# Altium project Traffic_Lignt_CU.PrjPCB
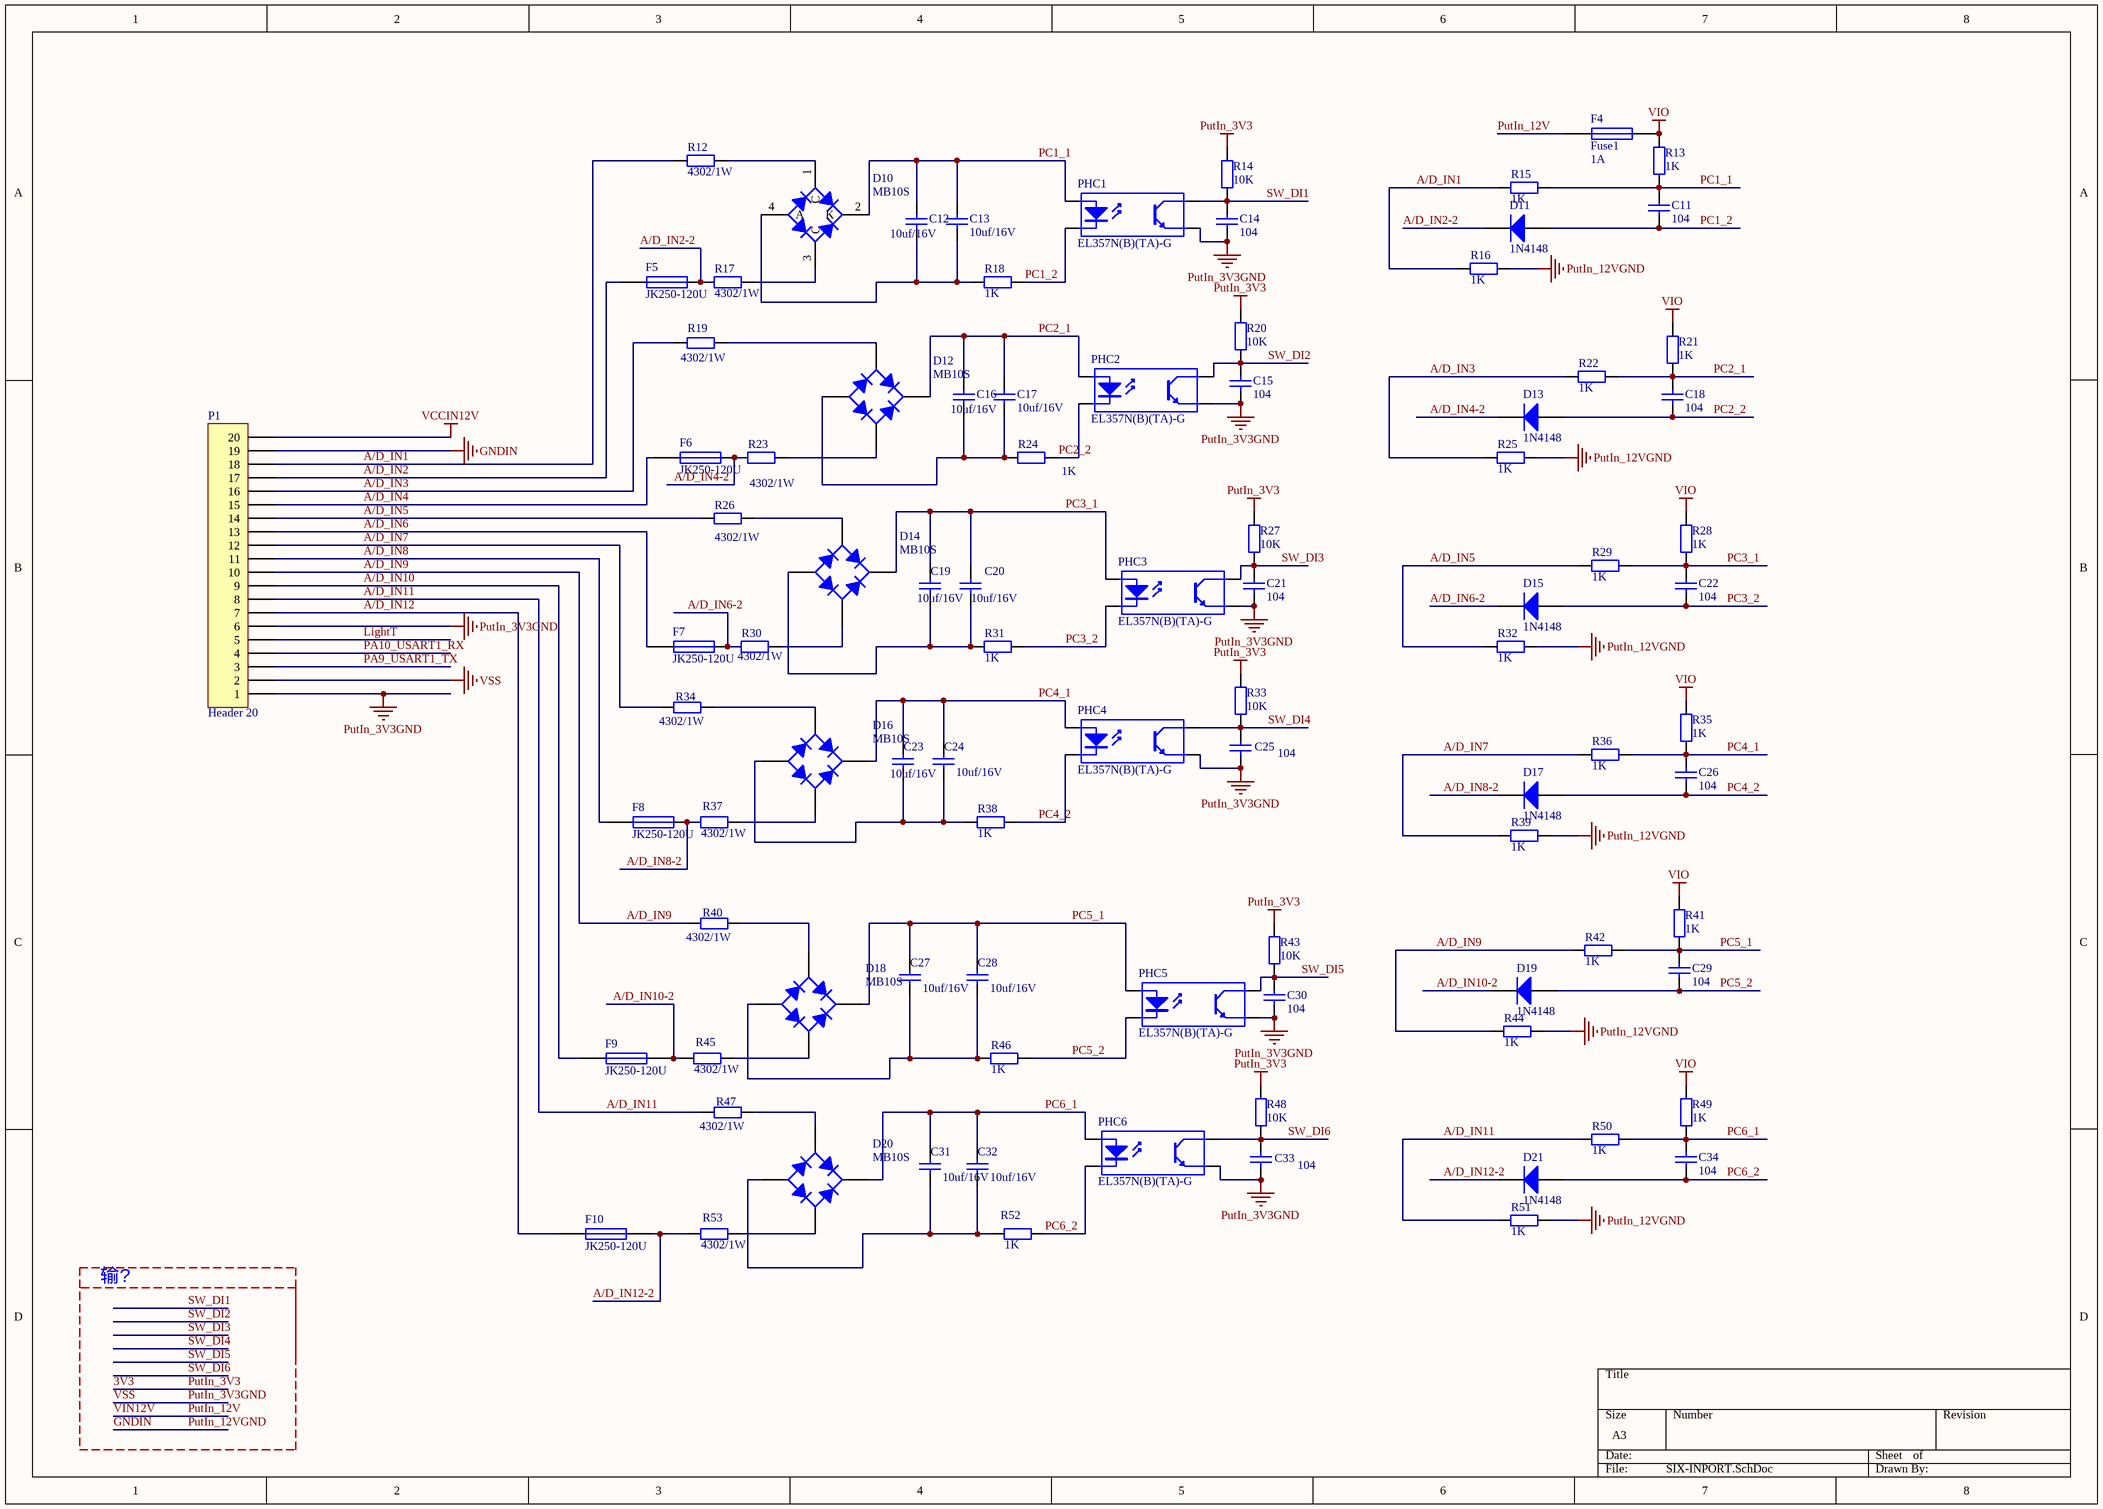
[diagram p0: SIX-INPORT.SchDoc]
5 sheets, 302 parts. Net scope: global (net labels, ports and power ports of the same name join across sheets).
Board file: PCB_LU_V2.2PcbDoc.PcbDoc
Sheets:
  SIX-INPORT.SchDoc
  RS485.SchDoc
  SIX_OUTPORT-V2.SchDoc
  POWER.SchDoc
  STM32F103最小系统板.SchDoc

## Sheet SIX-INPORT.SchDoc
size A3

### Parts
(Parts that share a designator on the sheet are numbered #1, #2 ... from top to bottom, then left to right.)
C11  104  [LC-1206_C]
C12  10uf/16V  [LC-0805_C]
C13  10uf/16V  [LC-0805_C]
C14#1  104  [LC-0603_C]
C15#1  104  [LC-0603_C]
C16  10uf/16V  [LC-0805_C]
C17  10uf/16V  [LC-0805_C]
C18#1  104  [LC-1206_C]
C19#1  10uf/16V  [LC-0805_C]
C20  10uf/16V  [LC-0805_C]
C21  104  [LC-0603_C]
C22  104  [LC-1206_C]
C23#1  10uf/16V  [LC-0805_C]
C24  10uf/16V  [LC-0805_C]
C25  104  [LC-0603_C]
C26  104  [LC-1206_C]
C27  10uf/16V  [LC-0805_C]
C28  10uf/16V  [LC-0805_C]
C29  104  [LC-1206_C]
C30  104  [LC-0603_C]
C31  10uf/16V  [LC-0805_C]
C32  10uf/16V  [LC-0805_C]
C33  104  [LC-0603_C]
C34  104  [LC-1206_C]
D10  MB10S  [LC-MBS]
D11  1N4148  [LC-LL-34]
D12  MB10S  [LC-MBS]
D13  1N4148  [LC-LL-34]
D14  MB10S  [LC-MBS]
D15  1N4148  [LC-LL-34]
D16#1  MB10S  [LC-MBS]
D17  1N4148  [LC-LL-34]
D18  MB10S  [LC-MBS]
D19  1N4148  [LC-LL-34]
D20  MB10S  [LC-MBS]
D21  1N4148  [LC-LL-34]
F4  Fuse1  value 1A  [LC-1206_R]
F5  JK250-120U  [ntc250v]
F6  JK250-120U  [ntc250v]
F7  JK250-120U  [ntc250v]
F8  JK250-120U  [ntc250v]
F9  JK250-120U  [ntc250v]
F10  JK250-120U  [ntc250v]
P1  Header 20  [HDR_5.0_20P]
PHC1  EL357N(B)(TA)-G  [LC-SOP-4_P2.54]
PHC2  EL357N(B)(TA)-G  [LC-SOP-4_P2.54]
PHC3  EL357N(B)(TA)-G  [LC-SOP-4_P2.54]
PHC4  EL357N(B)(TA)-G  [LC-SOP-4_P2.54]
PHC5  EL357N(B)(TA)-G  [LC-SOP-4_P2.54]
PHC6  EL357N(B)(TA)-G  [LC-SOP-4_P2.54]
R12  4302/1W  [LC-2512_R]
R13  value 1K  [LC-1206_R]  (hidden comment: Res1)
R14  10K  [LC-0603_R]
R15#1  value 1K  [LC-1206_R]  (hidden comment: Res1)
R16#1  value 1K  [LC-1206_R]  (hidden comment: Res1)
R17#1  4302/1W  [LC-2512_R]
R18#1  1K  [LC-0603_R]
R19  4302/1W  [LC-2512_R]
R20  10K  [LC-0603_R]
R21  value 1K  [LC-1206_R]  (hidden comment: Res1)
R22  value 1K  [LC-1206_R]  (hidden comment: Res1)
R23  4302/1W  [LC-2512_R]
R24  1K  [LC-0603_R]
R25  value 1K  [LC-1206_R]  (hidden comment: Res1)
R26  4302/1W  [LC-2512_R]
R27  10K  [LC-0603_R]
R28#1  value 1K  [LC-1206_R]  (hidden comment: Res1)
R29  value 1K  [LC-1206_R]  (hidden comment: Res1)
R30  4302/1W  [LC-2512_R]
R31  1K  [LC-0603_R]
R32  value 1K  [LC-1206_R]  (hidden comment: Res1)
R33  10K  [LC-0603_R]
R34  4302/1W  [LC-2512_R]
R35  value 1K  [LC-1206_R]  (hidden comment: Res1)
R36  value 1K  [LC-1206_R]  (hidden comment: Res1)
R37  4302/1W  [LC-2512_R]
R38  1K  [LC-0603_R]
R39  value 1K  [LC-1206_R]  (hidden comment: Res1)
R40  4302/1W  [LC-2512_R]
R41  value 1K  [LC-1206_R]  (hidden comment: Res1)
R42  value 1K  [LC-1206_R]  (hidden comment: Res1)
R43  10K  [LC-0603_R]
R44  value 1K  [LC-1206_R]  (hidden comment: Res1)
R45  4302/1W  [LC-2512_R]
R46  1K  [LC-0603_R]
R47  4302/1W  [LC-2512_R]
R48  10K  [LC-0603_R]
R49  value 1K  [LC-1206_R]  (hidden comment: Res1)
R50  value 1K  [LC-1206_R]  (hidden comment: Res1)
R51  value 1K  [LC-1206_R]  (hidden comment: Res1)
R52  1K  [LC-0603_R]
R53  4302/1W  [LC-2512_R]

### Nets
3V3: R14.2 R20.2 R27.2 R33.2 R43.2 R48.2  [also labelled PutIn_3V3]
GNDIN: P1.19 R16#1.1 R25.1 R32.1 R39.1 R44.1 R51.1  [also labelled PutIn_12VGND]
PutIn_3V3GND: C14#1.2 C15#1.2 C21.2 C25.2 C30.2 C33.2 P1.1 P1.2 P1.6 PHC1.3(E) PHC2.3(E) PHC3.3(E) PHC4.3(E) PHC5.3(E) PHC6.3(E)  [also labelled VSS]
PutIn_12V: F4.1  [also labelled VIN12V]
VCCIN12V: P1.20
VIO: F4.2 R13.2 R21.1 R28#1.1 R35.1 R41.1 R49.1
A/D_IN1: P1.18 R12.1 R15#1.2 R16#1.2
A/D_IN2: F5.1 P1.17
A/D_IN2-2: D11.2(K) F5.2 R17#1.1
A/D_IN3: P1.16 R19.1 R22.2 R25.2
A/D_IN4: F6.1 P1.15
A/D_IN4-2: D13.2(K) F6.2 R23.1
A/D_IN5: P1.14 R26.1 R29.2 R32.2
A/D_IN6: F7.1 P1.13
A/D_IN6-2: D15.2(K) F7.2 R30.1
A/D_IN7: P1.12 R34.1 R36.2 R39.2
A/D_IN8: F8.1 P1.11
A/D_IN8-2: D17.2(K) F8.2 R37.1
A/D_IN9: P1.10 R40.1 R42.2 R44.2
A/D_IN10: F9.1 P1.9
A/D_IN10-2: D19.2(K) F9.2 R45.1
A/D_IN11: P1.8 R47.1 R50.2 R51.2
A/D_IN12: F10.1 P1.7
A/D_IN12-2: D21.2(K) F10.2 R53.1
LightT: P1.5
PA9_USART1_TX: P1.3
PA10_USART1_RX: P1.4
PC1_1: C11.1 C12.2 C13.2 D10.2(K) PHC1.1(A) R13.1 R15#1.1
PC1_2: C11.2 D11.1(A) PHC1.2(K) R18#1.1
PC2_1: C16.2 C17.2 C18#1.1 D12.2(K) PHC2.1(A) R21.2 R22.1
PC2_2: C18#1.2 D13.1(A) PHC2.2(K) R24.1
PC3_1: C19#1.2 C20.2 C22.1 D14.2(K) PHC3.1(A) R28#1.2 R29.1
PC3_2: C22.2 D15.1(A) PHC3.2(K) R31.1
PC4_1: C23#1.2 C24.2 C26.1 D16#1.2(K) PHC4.1(A) R35.2 R36.1
PC4_2: C26.2 D17.1(A) PHC4.2(K) R38.1
PC5_1: C27.2 C28.2 C29.1 D18.2(K) PHC5.1(A) R41.2 R42.1
PC5_2: C29.2 D19.1(A) PHC5.2(K) R46.1
PC6_1: C31.2 C32.2 C34.1 D20.2(K) PHC6.1(A) R49.2 R50.1
PC6_2: C34.2 D21.1(A) PHC6.2(K) R52.1
SW_DI1: C14#1.1 PHC1.4(C) R14.1
SW_DI2: C15#1.1 PHC2.4(C) R20.1
SW_DI3: C21.1 PHC3.4(C) R27.1
SW_DI4: C25.1 PHC4.4(C) R33.1
SW_DI5: C30.1 PHC5.4(C) R43.1
SW_DI6: C33.1 PHC6.4(C) R48.1
NetC12_1: C12.1 C13.1 D10.4(A) R18#1.2
NetC16_1: C16.1 C17.1 D12.4(A) R24.2
NetC19#1_1: C19#1.1 C20.1 D14.4(A) R31.2
NetC23#1_1: C23#1.1 C24.1 D16#1.4(A) R38.2
NetC27_1: C27.1 C28.1 D18.4(A) R46.2
NetC31_1: C31.1 C32.1 D20.4(A) R52.2
NetD10_1: D10.1(C) R12.2
NetD10_3: D10.3(C) R17#1.2
NetD12_1: D12.1(C) R19.2
NetD12_3: D12.3(C) R23.2
NetD14_1: D14.1(C) R26.2
NetD14_3: D14.3(C) R30.2
NetD16#1_1: D16#1.1(C) R34.2
NetD16#1_3: D16#1.3(C) R37.2
NetD18_1: D18.1(C) R40.2
NetD18_3: D18.3(C) R45.2
NetD20_1: D20.1(C) R47.2
NetD20_3: D20.3(C) R53.2

### Notes on the sheet
- 输?

### Library data of the parts
C11 C18#1 C22 C26 C29 C34 = Cap: Capacitor; Value: 100nF; Published: 8-Jun-2000; Revision: July-2002: Re-released for DXP Platform.; Publisher: Altium Limited
C12 C13 C14#1 C15#1 C16 C17 C19#1 C20 C21 C23#1 C24 C25 C27 C28 C30-C33 = Cap: Capacitor; Value: 100pF; Published: 8-Jun-2000; LatestRevisionDate: 17-Jul-2002; LatestRevisionNote: Re-released for DXP Platform.; PackageReference: RAD-0.3; Publisher: Altium Limited; PackageDescription: Radial Cap, Thru-Hole; 2 Leads; 0.3 in Pin Spacing
D10 D12 D14 D16#1 D18 D20 = MBS: 整流桥; ComponentLink1Description: 供应商链接; ComponentLink1URL: http://www.szlcsc.com/product/details_2865.html; Package: MBS; Supplier: LC; SuppliersPartNumber: C2488
D11 D13 D15 D17 D19 D21 = Diode: Default Diode; Published: 8-Jun-2000; LatestRevisionDate: 17-Jul-2002; LatestRevisionNote: Re-released for DXP Platform.; PackageDocument: Sep-1996; PackageReference: SMC; Publisher: Altium Limited; Code_JEDEC: DO-214-AB
F4 = F: 保险丝
F5-F10 = Fuse1: 保险丝; Value: 1A
P1 = Header 20: Header, 20-Pin; LatestRevisionDate: 17-Jul-2002; LatestRevisionNote: Re-released for DXP Platform.; Publisher: Altium Limited
PHC1-PHC6 = EL357N: 贴片光耦; ComponentLink1Description: 供应商链接; ComponentLink1URL: http://www.szlcsc.com/product/details_7114.html; Package: SOP-4_P2.54; Supplier: LC; SuppliersPartNumber: C6649
R12 R14 R17#1 R19 R20 R23 R26 R27 R30 R33 R34 R37 R40 R43 R45 R47 R48 R53 = Res2: Resistor; Value: 1K; Published: 8-Jun-2000; LatestRevisionDate: 17-Jul-2002; LatestRevisionNote: Re-released for DXP Platform.; PackageReference: AXIAL-0.4; Publisher: Altium Limited; PackageDescription: Axial Device, Thru-Hole; 2 Leads; 0.4 in Pin Spacing
R13 R15#1 R16#1 R21 R22 R25 R28#1 R29 R32 R35 R36 R39 R41 R42 R44 R49-R51 = R: 贴片电阻; Published: 8-Jun-2000; LatestRevisionDate: 17-Jul-2002; LatestRevisionNote: Re-released for DXP Platform.; PackageReference: AXIAL-0.4; Publisher: Altium Limited
R18#1 R24 R31 R38 R46 R52 = Res2: Resistor; Published: 8-Jun-2000; LatestRevisionDate: 17-Jul-2002; LatestRevisionNote: Re-released for DXP Platform.; PackageReference: AXIAL-0.4; Publisher: Altium Limited; PackageDescription: Axial Device, Thru-Hole; 2 Leads; 0.4 in Pin Spacing; Value: 1K

## Sheet RS485.SchDoc
size A4
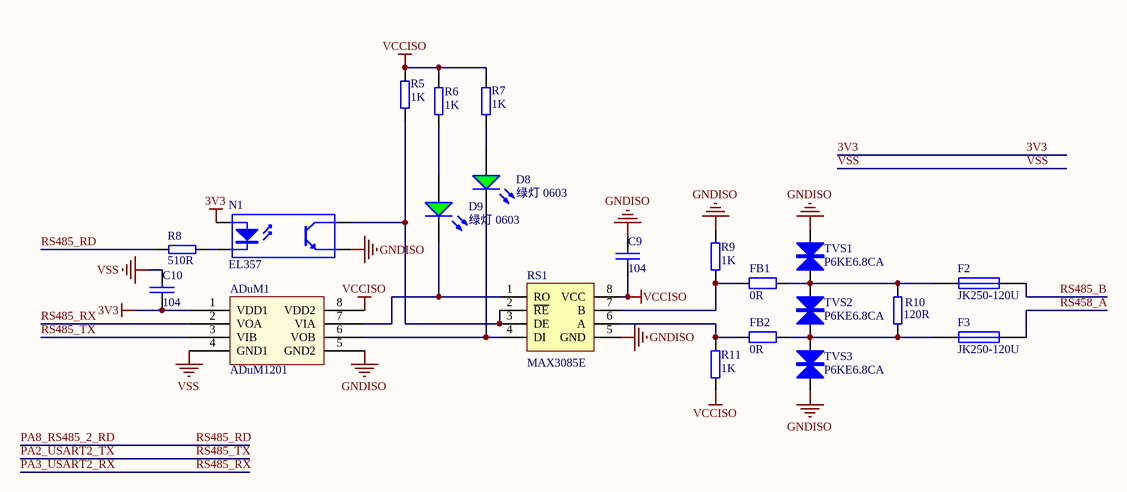
[diagram p1: RS485.SchDoc]

### Parts
(Parts that share a designator on the sheet are numbered #1, #2 ... from top to bottom, then left to right.)
ADuM1  ADuM1201  [SOIC-8]
C9  104  [LC-0603_C]
C10  104  [LC-0603_C]
D8  绿灯 0603  [0603_LED_G]
D9  绿灯 0603  [0603_LED_G]
F2#1  JK250-120U  [ntc250v]
F3  JK250-120U  [ntc250v]
FB1  0R  [LC-0603_L]
FB2  0R  [LC-0603_L]
N1  EL357  [lc-sop-4_P2.54]
R5#1  1K  [LC-0603_R]
R6#1  1K  [LC-0603_R]
R7  1K  [LC-0603_R]
R8  510R  [LC-0603_R]
R9  1K  [LC-0603_R]
R10  120R  [LC-0603_R]
R11  1K  [LC-0603_R]
RS1  MAX3085E  [SOIC-8]
TVS1  P6KE6.8CA  [TVS]
TVS2  P6KE6.8CA  [TVS]
TVS3  P6KE6.8CA  [TVS]

### Nets
3V3: ADuM1.1(VDD1) C10.2 N1.1(A)
GNDISO: ADuM1.5(GND2) C9.1 N1.3(E) R9.1 RS1.5(GND) TVS1.2 TVS3.1
VCCISO: ADuM1.8(VDD2) C9.2 R5#1.1 R6#1.2 R7.1 R11.2 RS1.8(VCC)
VSS: ADuM1.4(GND1) C10.1  [project net PutIn_3V3GND]
PA2_USART2_TX: ADuM1.3(VIB)  [also labelled RS485_TX]
PA3_USART2_RX: ADuM1.2(VOA)  [also labelled RS485_RX]
PA8_RS485_2_RD: R8.1  [also labelled RS485_RD]
RS458_A: F3.2
RS485_B: F2#1.2
NetADuM1_6: ADuM1.6(VOB) D8.K RS1.4(DI)
NetADuM1_7: ADuM1.7(VIA) D9.K RS1.1(RO)
NetD8_A: D8.A R7.2
NetD9_A: D9.A R6#1.1
NetF2#1_1: F2#1.1 FB1.1 R10.2 TVS1.1 TVS2.2
NetF3_1: F3.1 FB2.1 R10.1 TVS2.1 TVS3.2
NetFB1_2: FB1.2 R9.2 RS1.7(B)
NetFB2_2: FB2.2 R11.1 RS1.6(A)
NetN1_2: N1.2(K) R8.2
NetN1_4: N1.4(C) R5#1.2 RS1.2(~{RE}) RS1.3(DE)

### Library data of the parts
C9 C10 = CAP
D8 D9 = 0: 发光二极管; ComponentLink1Descrip: 供应商链接; ComponentLink1URL: http://www.szlcsc.com/product/details_73152.html; Package: 0603; Supplier: LC; SuppliersPartNumber: C72043
F2#1 F3 = F: 保险丝; Value: 1A
FB1 FB2 = Res2: Resistor; Published: 8-Jun-2000; LatestRevisionDate: 17-Jul-2002; LatestRevisionNote: Re-released for DXP Platform.; PackageReference: AXIAL-0.4; Publisher: Altium Limited; Value: 0R
N1 = ST188: 反射式光电传感器; Published: 24-Mar-1999; LatestRevisionDate: 04-Mar-2005; LatestRevisionNote: Sch pins 3 & 4 Swapped.; DatasheetDocument: Nov-2003; PackageReference: DIP-4; Publisher: Altium Limited
R5#1 R6#1 R7 R8 = RES2
R9-R11 = RES
TVS1-TVS3 = TVS

## Sheet SIX_OUTPORT-V2.SchDoc
size A3
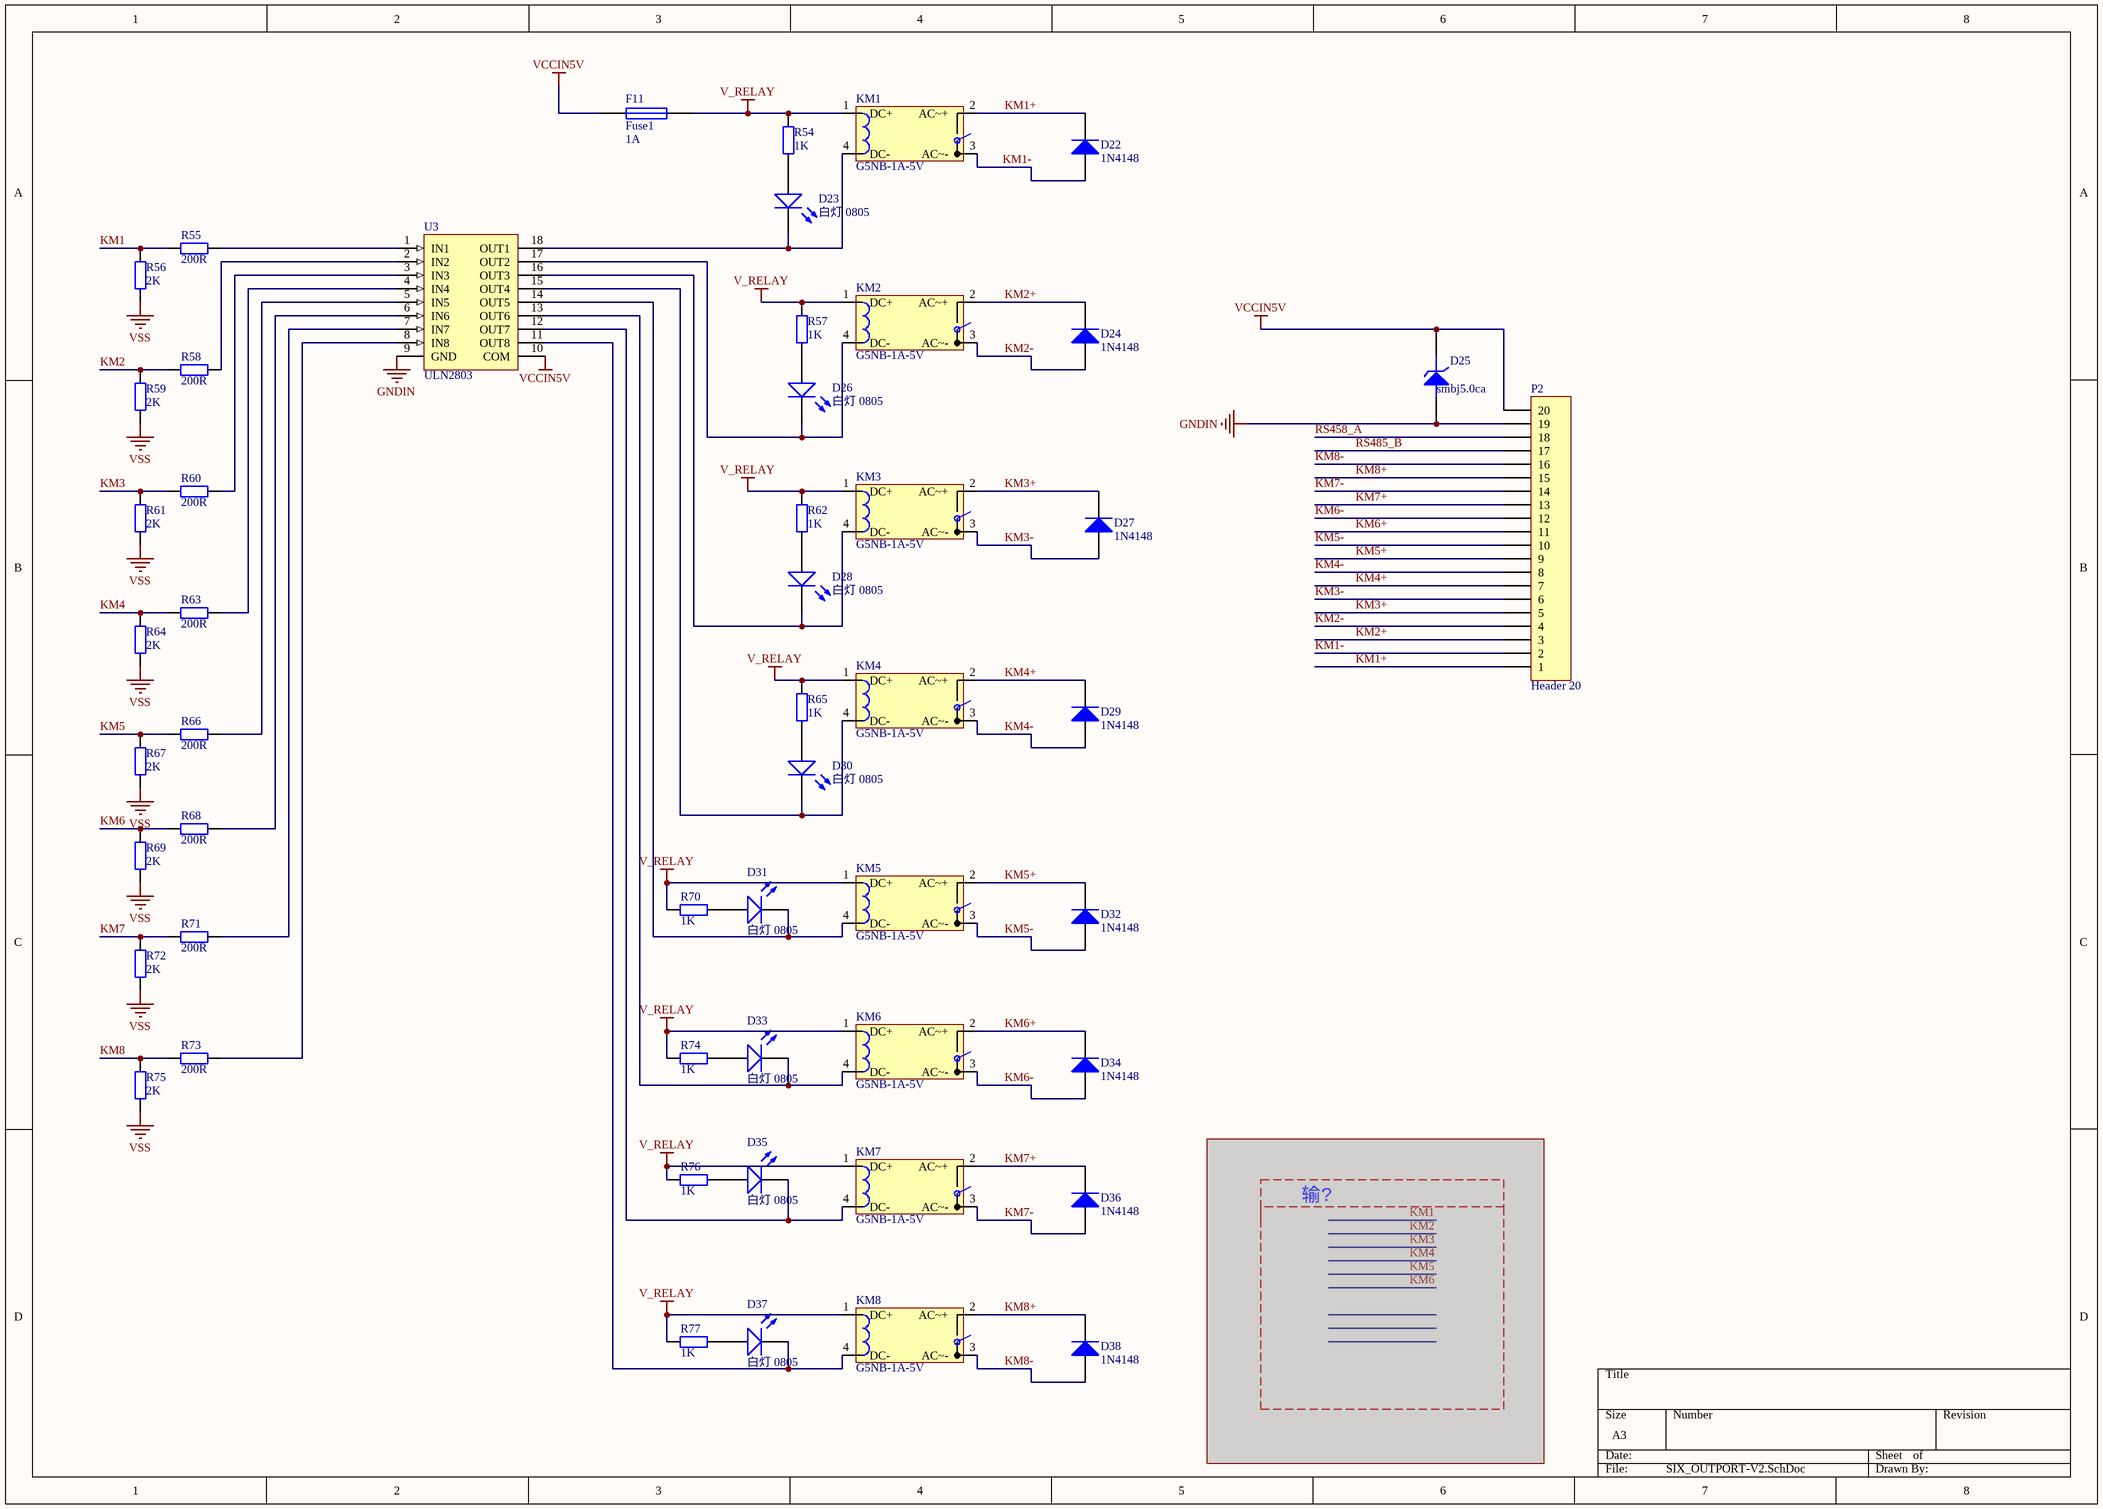
[diagram p2: SIX_OUTPORT-V2.SchDoc]

### Parts
D22  1N4148  [LC-LL-34]
D23  白灯 0805  [LC-0603_LED_S1]
D24  1N4148  [LC-LL-34]
D25  smbj5.0ca  [LC-SMB(DO-214AA)_S1]
D26  白灯 0805  [LC-0603_LED_S1]
D27  1N4148  [LC-LL-34]
D28  白灯 0805  [LC-0603_LED_S1]
D29  1N4148  [LC-LL-34]
D30  白灯 0805  [LC-0603_LED_S1]
D31  白灯 0805  [LC-0603_LED_S1]
D32  1N4148  [LC-LL-34]
D33  白灯 0805  [LC-0603_LED_S1]
D34  1N4148  [LC-LL-34]
D35  白灯 0805  [LC-0603_LED_S1]
D36  1N4148  [LC-LL-34]
D37  白灯 0805  [LC-0603_LED_S1]
D38  1N4148  [LC-LL-34]
F11  Fuse1  value 1A  [LC-1206_R]
KM1  G5NB-1A-5V  [G5NB-1A-5V]
KM2  G5NB-1A-5V  [G5NB-1A-5V]
KM3  G5NB-1A-5V  [G5NB-1A-5V]
KM4  G5NB-1A-5V  [G5NB-1A-5V]
KM5  G5NB-1A-5V  [G5NB-1A-5V]
KM6  G5NB-1A-5V  [G5NB-1A-5V]
KM7  G5NB-1A-5V  [G5NB-1A-5V]
KM8  G5NB-1A-5V  [G5NB-1A-5V]
P2  Header 20  [HDR_5.0_20P]
R54  1K  [LC-0603_R]
R55  200R  [LC-0603_R]
R56  2K  [LC-0603_R]
R57  1K  [LC-0603_R]
R58  200R  [LC-0603_R]
R59  2K  [LC-0603_R]
R60  200R  [LC-0603_R]
R61  2K  [LC-0603_R]
R62  1K  [LC-0603_R]
R63  200R  [LC-0603_R]
R64  2K  [LC-0603_R]
R65  1K  [LC-0603_R]
R66  200R  [LC-0603_R]
R67  2K  [LC-0603_R]
R68  200R  [LC-0603_R]
R69  2K  [LC-0603_R]
R70  1K  [LC-0603_R]
R71  200R  [LC-0603_R]
R72  2K  [LC-0603_R]
R73  200R  [LC-0603_R]
R74  1K  [LC-0603_R]
R75  2K  [LC-0603_R]
R76  1K  [LC-0603_R]
R77  1K  [LC-0603_R]
U3  ULN2803  [LC-SOIC-18_300mil]

### Nets
GNDIN: D25.1(A) P2.19 U3.9(GND)
V_RELAY: F11.2 KM1.1(DC+) KM2.1(DC+) KM3.1(DC+) KM4.1(DC+) KM5.1(DC+) KM6.1(DC+) KM7.1(DC+) KM8.1(DC+) R54.1 R57.1 R62.1 R65.1 R70.1 R74.1 R76.1 R77.1
VCCIN5V: D25.2(K) F11.1 P2.20 U3.10(COM)
VSS: R56.2 R59.2 R61.2 R64.2 R67.2 R69.2 R72.2 R75.2  [project net PutIn_3V3GND]
KM1: R55.2 R56.1
KM1+: D22.2(K) KM1.2(AC~+) P2.1
KM1-: D22.1(A) KM1.3(AC~-) P2.2
KM2: R58.2 R59.1
KM2+: D24.2(K) KM2.2(AC~+) P2.3
KM2-: D24.1(A) KM2.3(AC~-) P2.4
KM3: R60.2 R61.1
KM3+: D27.2(K) KM3.2(AC~+) P2.5
KM3-: D27.1(A) KM3.3(AC~-) P2.6
KM4: R63.2 R64.1
KM4+: D29.2(K) KM4.2(AC~+) P2.7
KM4-: D29.1(A) KM4.3(AC~-) P2.8
KM5: R66.2 R67.1
KM5+: D32.2(K) KM5.2(AC~+) P2.9
KM5-: D32.1(A) KM5.3(AC~-) P2.10
KM6: R68.2 R69.1
KM6+: D34.2(K) KM6.2(AC~+) P2.11
KM6-: D34.1(A) KM6.3(AC~-) P2.12
KM7: R71.2 R72.1
KM7+: D36.2(K) KM7.2(AC~+) P2.13
KM7-: D36.1(A) KM7.3(AC~-) P2.14
KM8: R73.2 R75.1
KM8+: D38.2(K) KM8.2(AC~+) P2.15
KM8-: D38.1(A) KM8.3(AC~-) P2.16
RS458_A: P2.18
RS485_B: P2.17
NetD23_A: D23.A R54.2
NetD23_K: D23.K KM1.4(DC-) U3.18(OUT1)
NetD26_A: D26.A R57.2
NetD26_K: D26.K KM2.4(DC-) U3.17(OUT2)
NetD28_A: D28.A R62.2
NetD28_K: D28.K KM3.4(DC-) U3.16(OUT3)
NetD30_A: D30.A R65.2
NetD30_K: D30.K KM4.4(DC-) U3.15(OUT4)
NetD31_A: D31.A R70.2
NetD31_K: D31.K KM5.4(DC-) U3.14(OUT5)
NetD33_A: D33.A R74.2
NetD33_K: D33.K KM6.4(DC-) U3.13(OUT6)
NetD35_A: D35.A R76.2
NetD35_K: D35.K KM7.4(DC-) U3.12(OUT7)
NetD37_A: D37.A R77.2
NetD37_K: D37.K KM8.4(DC-) U3.11(OUT8)
NetR55_1: R55.1 U3.1(IN1)
NetR58_1: R58.1 U3.2(IN2)
NetR60_1: R60.1 U3.3(IN3)
NetR63_1: R63.1 U3.4(IN4)
NetR66_1: R66.1 U3.5(IN5)
NetR68_1: R68.1 U3.6(IN6)
NetR71_1: R71.1 U3.7(IN7)
NetR73_1: R73.1 U3.8(IN8)

### Notes on the sheet
- 输?

### Library data of the parts
D22 D24 D27 D29 D32 D34 D36 D38 = Diode: Default Diode; Published: 8-Jun-2000; LatestRevisionDate: 17-Jul-2002; LatestRevisionNote: Re-released for DXP Platform.; PackageDocument: Sep-1996; PackageReference: SMC; Publisher: Altium Limited; Code_JEDEC: DO-214-AB
D23 D26 D28 D30 D31 D33 D35 D37 = 0805 白灯: 发光二极管; ComponentLink1Description: 供应商链接; ComponentLink1URL: http://www.szlcsc.com/product/details_35468.html; Package: 0805; Supplier: LC; SuppliersPartNumber: C34499
D25 = ZENER3: Zener Diode
F11 = Fuse1: 保险丝
P2 = Header 20: Header, 20-Pin; LatestRevisionDate: 17-Jul-2002; LatestRevisionNote: Re-released for DXP Platform.; Publisher: Altium Limited
R54 R57 R62 R65 R70 R74 R76 R77 = Res2: Resistor; Published: 8-Jun-2000; LatestRevisionDate: 17-Jul-2002; LatestRevisionNote: Re-released for DXP Platform.; PackageReference: AXIAL-0.4; Publisher: Altium Limited; Value: 1K
R55 R56 R58-R61 R63 R64 R66-R69 R71-R73 R75 = Res2: Resistor; Value: 1K; Published: 8-Jun-2000; LatestRevisionDate: 17-Jul-2002; LatestRevisionNote: Re-released for DXP Platform.; PackageReference: AXIAL-0.4; Publisher: Altium Limited

## Sheet POWER.SchDoc
size A4
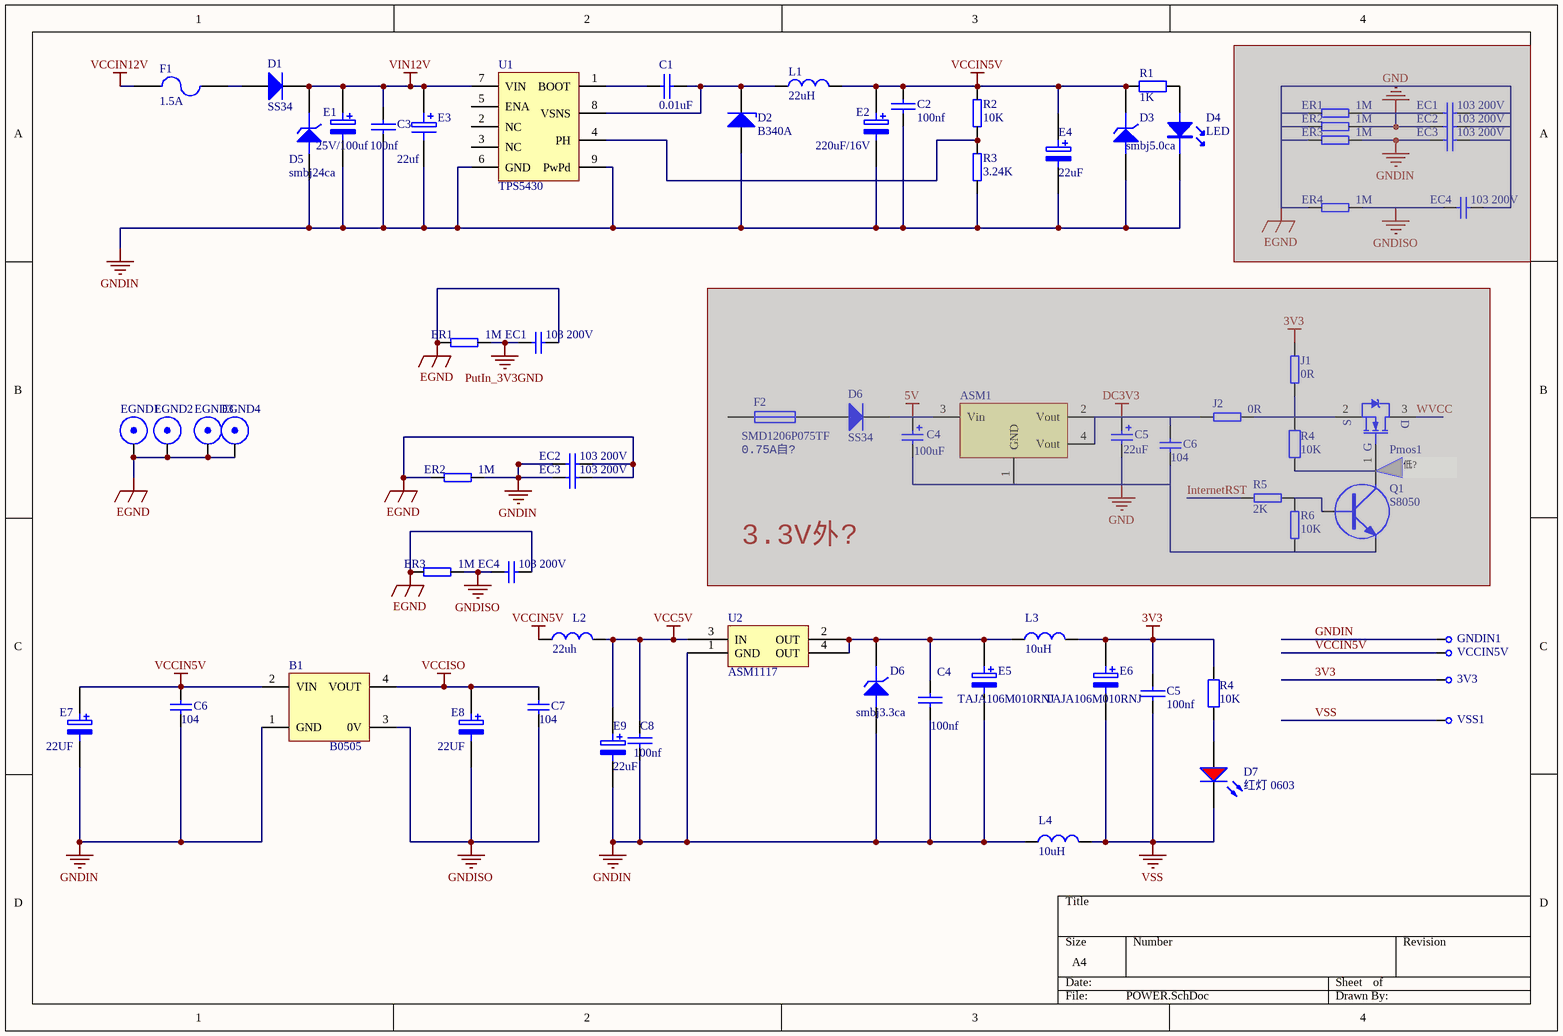
[diagram p3: POWER.SchDoc]

### Parts
(Parts that share a designator on the sheet are numbered #1, #2 ... from top to bottom, then left to right.)
3V3  CHECK  [CHECK-B]  (value not drawn)
ASM1  ASM1117-3.3  [LC-SOT-223]  (value not drawn)  (masked out: inside a compile mask, not in the netlist)
B1  B0505  [B0505D-1WR2]
C1  0.01uF  [LC-1206_C]
C2  100nf  [LC-0603_C]
C3  100nf  [LC-0603_C]
C4#1  100uF  [HONOR_63X54]  (masked out: inside a compile mask, not in the netlist)
C4#2  100nf  [LC-0603_C]
C5#1  22uF  [HONOR_63X54]  (masked out: inside a compile mask, not in the netlist)
C5#2  100nf  [LC-0603_C]
C6#1  104  [LC-0603_C]  (masked out: inside a compile mask, not in the netlist)
C6#2  104  [LC-0603_C]
C7  104  [LC-0603_C]
C8  100nf  [LC-0603_C]
D1  SS34  [LC-SMA(DO-214AC)_S1]
D2  value B340A  [LC-SMA(DO-214AC)_S1]  (hidden comment: Diode-Z)
D3  smbj5.0ca  [LC-SMB(DO-214AA)_S1]
D4  LED  [0603_LED_G]
D5  smbj24ca  [LC-SMB(DO-214AA)_S1]
D6#1  SS34  [LC-SMA(DO-214AC)_S5]  (masked out: inside a compile mask, not in the netlist)
D6#2  smbj3.3ca  [LC-SMB(DO-214AA)_S1]
D7#1  红灯 0603  [LC-0603_LED_S1]
E1  25V/100uf  [C-RB-SD8]
E2  220uF/16V  [C-RB-SD6]
E3  22uf  [LC-CASE-B_3528]
E4  22uF  [LC-CASE-B_3528]
E5  TAJA106M010RNJ  [LC-CASE-A_3216]
E6#1  TAJA106M010RNJ  [LC-CASE-A_3216]
E7  22UF  [LC-CASE-B_3528]
E8  22UF  [LC-CASE-B_3528]
E9  22uF  [LC-CASE-B_3528]
EC1#1  103 200V  [LC-1206_C]  (masked out: inside a compile mask, not in the netlist)
EC1#2  103 200V  [LC-1206_C]
EC2#1  103 200V  [LC-1206_C]  (masked out: inside a compile mask, not in the netlist)
EC2#2  103 200V  [LC-1206_C]
EC3#1  103 200V  [LC-1206_C]  (masked out: inside a compile mask, not in the netlist)
EC3#2  103 200V  [LC-1206_C]
EC4#1  103 200V  [LC-1206_C]  (masked out: inside a compile mask, not in the netlist)
EC4#2  103 200V  [LC-1206_C]
EGND1  EGND  [H-6-3.2m]  (value not drawn)
EGND2  EGND  [H-6-3.2m]  (value not drawn)
EGND3  EGND  [H-6-3.2m]  (value not drawn)
EGND4  EGND  [H-6-3.2m]  (value not drawn)
ER1#1  1M  [LC-1206_R]  (masked out: inside a compile mask, not in the netlist)
ER1#2  1M  [LC-1206_R]
ER2#1  1M  [LC-1206_R]  (masked out: inside a compile mask, not in the netlist)
ER2#2  1M  [LC-1206_R]
ER3#1  1M  [LC-1206_R]  (masked out: inside a compile mask, not in the netlist)
ER3#2  1M  [LC-1206_R]
ER4  1M  [LC-1206_R]  (masked out: inside a compile mask, not in the netlist)
F1  value 1.5A  [1812]  (hidden comment: Fuse2)
F2#2  SMD1206P075TF  [LC-1206_R]  (masked out: inside a compile mask, not in the netlist)
GNDIN1  CHECK  [CHECK-B]  (value not drawn)
J1#1  0R  [LC-0603_L]  (masked out: inside a compile mask, not in the netlist)
J2#1  0R  [LC-0603_L]  (masked out: inside a compile mask, not in the netlist)
L1  value 22uH  [L-SMD-7]  (hidden comment: Inductor)
L2  22uh  [L-SMD-3012]
L3  value 10uH  [LC-0805_L]  (hidden comment: Inductor)
L4  value 10uH  [LC-0805_L]  (hidden comment: Inductor)
Pmos1  SI2301  [LC-SOT-23(SOT-23-3)]  (value not drawn)  (masked out: inside a compile mask, not in the netlist)
Q1  S8050  [LC-SOT-23(SOT-23-3)]  (masked out: inside a compile mask, not in the netlist)
R1  1K  [LC-0603_R]
R2  10K  [LC-0603_R]
R3  3.24K  [LC-0603_R]
R4#1  10K  [LC-0603_R]  (masked out: inside a compile mask, not in the netlist)
R4#2  10K  [LC-0603_R]
R5#2  2K  [LC-0603_R]  (masked out: inside a compile mask, not in the netlist)
R6#2  10K  [LC-0603_R]  (masked out: inside a compile mask, not in the netlist)
U1  TPS5430  [TPS5430]
U2  ASM1117  [SOT223]
VCCIN5V  CHECK  [CHECK-B]  (value not drawn)
VSS1  CHECK  [CHECK-B]  (value not drawn)

### Nets
3V3: 3V3.1 C5#2.2 E6#1.1 L3.2 R4#2.1
EGND: EC1#2.1 EC2#2.1 EC3#2.1 EC4#2.1 EGND1.0 EGND2.0 EGND3.0 EGND4.0 ER1#2.1 ER2#2.1 ER3#2.1
GNDIN: B1.1(GND) C2.1 C3.1 C4#2.1 C6#2.2 C8.1 D2.1(A) D3.1(A) D4.K D5.1(A) D6#2.1(A) E1.2 E2.2 E3.2 E4.2 E5.2 E7.2 E9.2 EC2#2.2 EC3#2.2 ER2#2.2 GNDIN1.1 L4.1 R3.2 U1.6(GND) U1.9(PwPd) U2.1(GND)
GNDISO: B1.3(0V) C7.2 E8.2 EC4#2.2 ER3#2.2
PutIn_3V3GND: C5#2.1 D7#1.K E6#1.2 EC1#2.2 ER1#2.2 L4.2 VSS1.1  [also labelled VSS]
VCC5V: C8.2 E9.1 L2.2 U2.3(IN)
VCCIN5V: B1.2(VIN) C2.2 C6#2.1 D3.2(K) E2.1 E4.1 E7.1 L1.2 L2.1 R1.1 R2.2 VCCIN5V.1
VCCIN12V: F1.1
VCCISO: B1.4(VOUT) C7.1 E8.1
VIN12V: C3.2 D1.2(K) D5.2(K) E1.1 E3.1 U1.7(VIN)  [project net PutIn_12V]
NetC1_1: C1.1 D2.2(K) L1.1 U1.8(VSNS)
NetC1_2: C1.2 U1.1(BOOT)
NetC4#2_2: C4#2.2 D6#2.2(K) E5.1 L3.1 U2.2(OUT) U2.4(OUT)
NetD1_1: D1.1(A) F1.2
NetD4_A: D4.A R1.2
NetD7#1_A: D7#1.A R4#2.2
NetR2_1: R2.1 R3.1 U1.4(PH)

Not connected (* = marked no-connect by the designer): U1 2(NC) 3(NC) 5(ENA)

### Notes on the sheet
- (near F2#2) 0.75A自?
- 低?
- 3.3V外?

### Library data of the parts
3V3 = CHE: 测试点
ASM1 = VOLTREG1
C1-C3 C4#2 C5#2 C8 = CAP: Capacitor
C4#1 C5#1 = Cap Pol1: Polarized Capacitor (Radial); Published: 8-Jun-2000; Revision: July-2002: Re-released for DXP Platform.; Publisher: Altium Limited
  C4#1: Value: 100uF
  C5#1: Value: 22uF
C6#1 C6#2 C7 = Cap: Capacitor; Value: 100nF; Published: 8-Jun-2000; Revision: July-2002: Re-released for DXP Platform.; Publisher: Altium Limited
D1 = D: 二极管; Published: 8-Jun-2000; LatestRevisionDate: 17-Jul-2002; LatestRevisionNote: Re-released for DXP Platform.; PackageDocument: Sep-1996; PackageReference: SMC; Publisher: Altium Limited; Code_JEDEC: DO-214-AB
D2 = Dio: 稳压二极管; Published: 8-Jun-2000; LatestRevisionDate: 17-Jul-2002; LatestRevisionNote: Re-released for DXP Platform.; PackageReference: SMB; Publisher: Altium Limited; Code_JEDEC: DO-214-AA
D3 D5 D6#2 = ZENER3: Zener Diode
D6#1 = Diode: Default Diode; Published: 8-Jun-2000; LatestRevisionDate: 17-Jul-2002; LatestRevisionNote: Re-released for DXP Platform.; PackageDocument: Sep-1996; PackageReference: SMC; Publisher: Altium Limited; Code_JEDEC: DO-214-AB
D7#1 = 0603 红灯: 发光二极管; ComponentLink1Des: 供应商链接; ComponentLink1URL: http://www.szlcsc.com/product/details_2659.html; Package: 0603; Supplier: LC; SuppliersPartNumber: C2286
E1 E2 E4 E5 E6#1 E7-E9 = ELECTRO2: Electrolytic Capacitor
E3 = ELECTRO1: Electrolytic Capacitor
EC1#1 EC1#2 EC2#1 EC2#2 EC3#1 EC3#2 EC4#1 EC4#2 = Cap: Capacitor; Value: 103; Published: 8-Jun-2000; Revision: July-2002: Re-released for DXP Platform.; Publisher: Altium Limited
ER1#1 ER1#2 ER2#1 ER2#2 ER3#1 ER3#2 ER4 R2 R3 = RES2
F1 = Fuse2: 可恢复保险丝; Published: 8-Jun-2000; LatestRevisionDate: 17-Jul-2002; LatestRevisionNote: Re-released for DXP Platform.; PackageReference: PIN-W2/E2.8; Publisher: Altium Limited
F2#2 = Fuse 1: Fuse; Published: 8-Jun-2000; LatestRevisionDate: 17-Jul-2002; LatestRevisionNote: Re-released for DXP Platform.; PackageReference: PIN-W2/E2.8; Publisher: Altium Limited
GNDIN1 VCCIN5V VSS1 = C: 测试点
J1#1 J2#1 R5#2 R6#2 = RES
L1 L3 L4 = Ind: 电感; Code_IEC: 1005; Published: 8-Jun-2000; LatestRevisionDate: 17-Jul-2002; LatestRevisionNote: Re-released for DXP Platform.; PackageReference: 0402-A; Publisher: Altium Limited; Code_JEITA: 0402
L2 = Ind: 电感; Code_IEC: 1005; Value: 10uH; Published: 8-Jun-2000; LatestRevisionDate: 17-Jul-2002; LatestRevisionNote: Re-released for DXP Platform.; PackageReference: 0402-A; Publisher: Altium Limited; Code_JEITA: 0402
Pmos1 = N-MOS
Q1 = NPN
R1 R4#1 = Res2: Resistor; Published: 8-Jun-2000; LatestRevisionDate: 17-Jul-2002; LatestRevisionNote: Re-released for DXP Platform.; PackageReference: AXIAL-0.4; Publisher: Altium Limited
  R1: Value: 1K
  R4#1: Value: 10K
R4#2 = Res2: Resistor; Value: 1K; Published: 8-Jun-2000; LatestRevisionDate: 17-Jul-2002; LatestRevisionNote: Re-released for DXP Platform.; PackageReference: AXIAL-0.4; Publisher: Altium Limited
U2 = ASM1: 3.3V稳压芯片

## Sheet STM32F103最小系统板.SchDoc
size A3
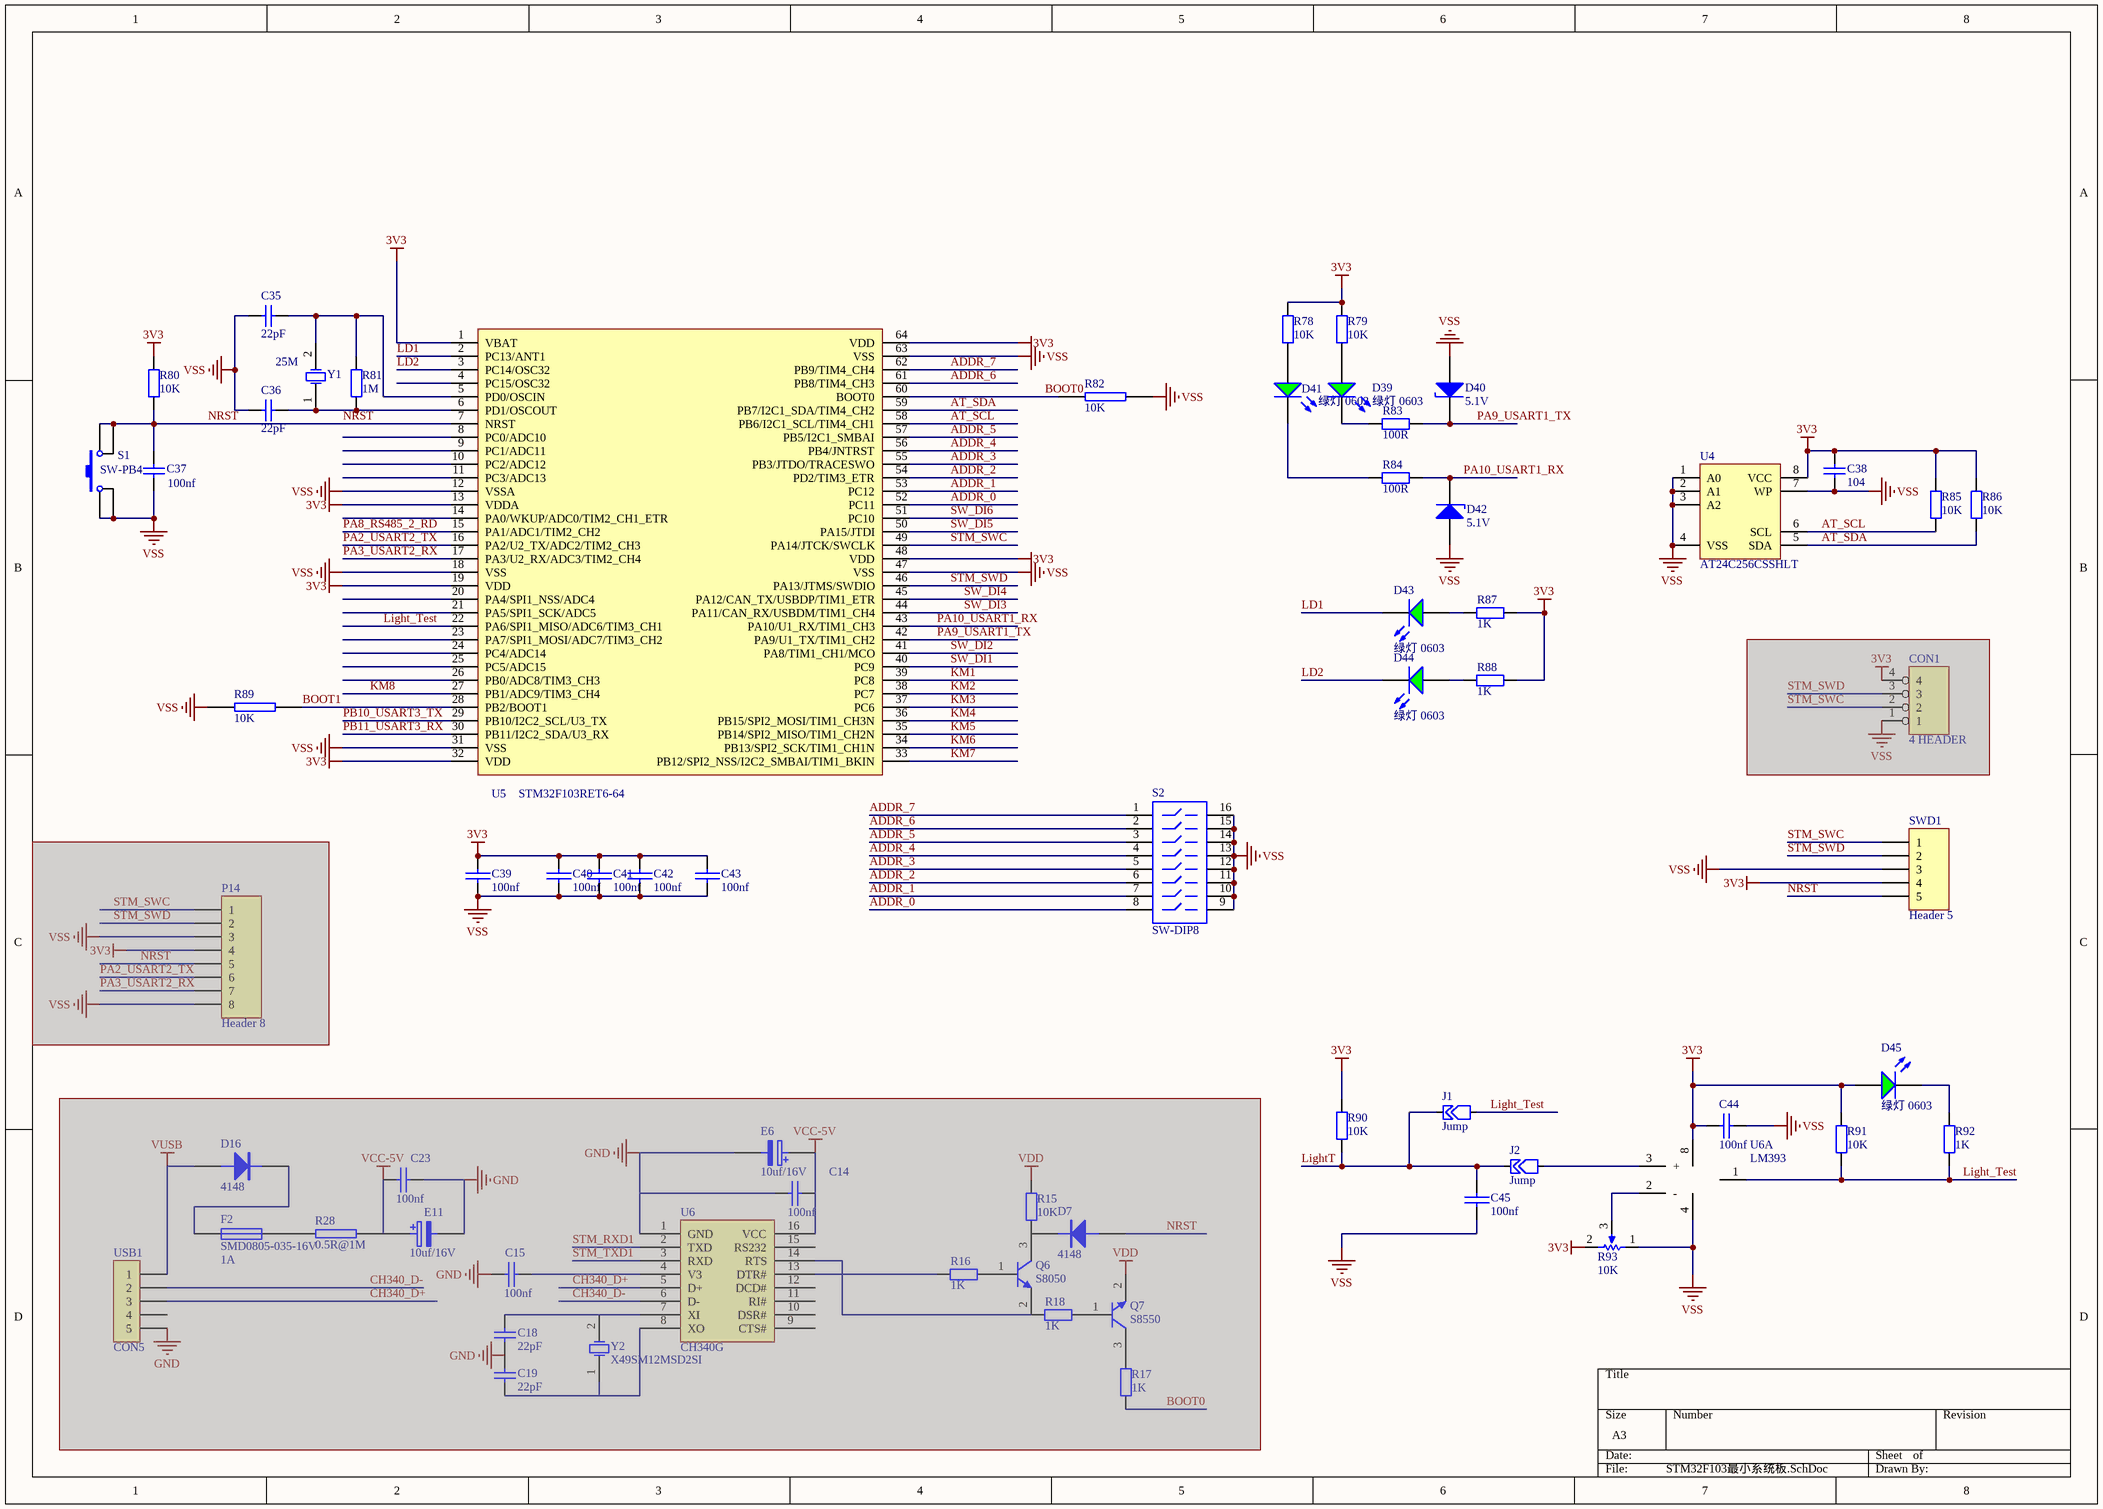
[diagram p4: STM32F103最小系统板.SchDoc]

### Parts
(Parts that share a designator on the sheet are numbered #1, #2 ... from top to bottom, then left to right.)
C14#2  100nf  [LC-0603_C]  (masked out: inside a compile mask, not in the netlist)
C15#2  100nf  [LC-0603_C]  (masked out: inside a compile mask, not in the netlist)
C18#2  22pF  [LC-0603_C]  (masked out: inside a compile mask, not in the netlist)
C19#2  22pF  [LC-0603_C]  (masked out: inside a compile mask, not in the netlist)
C23#2  100nf  [LC-0603_C]  (masked out: inside a compile mask, not in the netlist)
C35  22pF  [LC-0603_C]
C36  22pF  [LC-0603_C]
C37  100nf  [LC-0603_C]
C38  104  [LC-0603_C]
C39  100nf  [LC-0603_C]
C40  100nf  [LC-0603_C]
C41  100nf  [LC-0603_C]
C42  100nf  [LC-0603_C]
C43  100nf  [LC-0603_C]
C44  100nf  [LC-0603_C]
C45  100nf  [LC-0603_C]
CON1  4 HEADER  [sip4]  (masked out: inside a compile mask, not in the netlist)
D7#2  4148  [LC-LL-34]  (masked out: inside a compile mask, not in the netlist)
D16#2  4148  [LC-LL-34]  (masked out: inside a compile mask, not in the netlist)
D39  绿灯 0603  [0603_LED_G]
D40  value 5.1V  [D-1206]  (hidden comment: Diode-Z)
D41  绿灯 0603  [0603_LED_G]
D42  value 5.1V  [D-1206]  (hidden comment: Diode-Z)
D43  绿灯 0603  [LC-0603_LED_S1]
D44  绿灯 0603  [LC-0603_LED_S1]
D45  绿灯 0603  [0603_LED_G]
E6#2  10uf/16V  [LC-CASE-A_3216]  (masked out: inside a compile mask, not in the netlist)
E11  10uf/16V  [LC-CASE-A_3216]  (masked out: inside a compile mask, not in the netlist)
F2#3  SMD0805-035-16V  value 1A  [LC-0805_R]  (masked out: inside a compile mask, not in the netlist)
J1#2  Jump  [JT]
J2#2  Jump  [JT]
P14  Header 8  [HDR1X8]  (masked out: inside a compile mask, not in the netlist)
Q6  S8050  [LC-SOT-23(SOT-23-3)]  (masked out: inside a compile mask, not in the netlist)
Q7  S8550  [LC-SOT-23(SOT-23-3)]  (masked out: inside a compile mask, not in the netlist)
R15#2  10K  [LC-0603_R]  (masked out: inside a compile mask, not in the netlist)
R16#2  1K  [LC-0603_R]  (masked out: inside a compile mask, not in the netlist)
R17#2  1K  [LC-0603_R]  (masked out: inside a compile mask, not in the netlist)
R18#2  1K  [LC-0603_R]  (masked out: inside a compile mask, not in the netlist)
R28#2  0.5R@1M  [LC-0805_R]  (masked out: inside a compile mask, not in the netlist)
R78  10K  [LC-0603_R]
R79  10K  [LC-0603_R]
R80  10K  [LC-0603_R]
R81  1M  [LC-0603_R]
R82  10K  [LC-0603_R]
R83  value 100R  [LC-0603_R]  (hidden comment: 1K)
R84  value 100R  [LC-0603_R]  (hidden comment: 1K)
R85  10K  [LC-0603_R]
R86  10K  [LC-0603_R]
R87  1K  [LC-0603_R]
R88  1K  [LC-0603_R]
R89  10K  [LC-0603_R]
R90  value 10K  [LC-0603_R]  (hidden comment: 1K)
R91  value 10K  [LC-0603_R]  (hidden comment: 1K)
R92  1K  [LC-0603_R]
R93  10K  [3296W]
S1  SW-PB4  [SW_PB4_A1]
S2  SW-DIP8  [SW-DIP8]
SWD1  Header 5  [SWD-5]
U4  AT24C256CSSHLT  [SOIC-8]
U5  STM32F103RET6-64  [LC-LQFP-64_10x10x05P]
U6#1  LM393  [sop-8]  (part A of 2)
U6#2  CH340G  [LC-SOIC-16_150mil]
USB1  CON5  [USB_MICRO]  (masked out: inside a compile mask, not in the netlist)
Y1  25M  [LC-SMD-5032_2P]
Y2  X49SM12MSD2SI  [LC-HC-49SMD]  (masked out: inside a compile mask, not in the netlist)

### Nets
3V3: C38.1 C39.2 C40.2 C41.2 C42.2 C43.2 C44.2 D45.A R78.1 R79.1 R80.2 R85.1 R86.1 R87.1 R88.1 R90.1 R91.1 R93.2(BOT) SWD1.4 U4.8(VCC) U5.1(VBAT) U5.13(VDDA) U5.19(VDD) U5.32(VDD) U5.48(VDD) U5.64(VDD) U6#1.8(VCC)
VSS: C35.1 C36.1 C37.1 C38.2 C39.1 C40.1 C41.1 C42.1 C43.1 C44.1 C45.1 D40.1(A) D42.1(A) R82.1 R89.1 R93.1(TOP) S1.1 S1.4 S2.9 S2.10 S2.11 S2.12 S2.13 S2.14 S2.15 S2.16 SWD1.3 U4.1(A0) U4.2(A1) U4.3(A2) U4.4(VSS) U4.7(WP) U5.12(VSSA) U5.18(VSS) U5.31(VSS) U5.47(VSS) U5.63(VSS) U6#1.4(GND)  [project net PutIn_3V3GND]
ADDR_0: S2.8 U5.52(PC11)
ADDR_1: S2.7 U5.53(PC12)
ADDR_2: S2.6 U5.54(PD2/TIM3_ETR)
ADDR_3: S2.5 U5.55(PB3/JTDO/TRACESWO)
ADDR_4: S2.4 U5.56(PB4/JNTRST)
ADDR_5: S2.3 U5.57(PB5/I2C1_SMBAI)
ADDR_6: S2.2 U5.61(PB8/TIM4_CH3)
ADDR_7: S2.1 U5.62(PB9/TIM4_CH4)
AT_SCL: R85.2 U4.6(SCL) U5.58(PB6/I2C1_SCL/TIM4_CH1)
AT_SDA: R86.2 U4.5(SDA) U5.59(PB7/I2C1_SDA/TIM4_CH2)
BOOT0: R82.2 U5.60(BOOT0)
BOOT1: R89.2 U5.28(PB2/BOOT1)
KM1: U5.39(PC8)
KM2: U5.38(PC7)
KM3: U5.37(PC6)
KM4: U5.36(PB15/SPI2_MOSI/TIM1_CH3N)
KM5: U5.35(PB14/SPI2_MISO/TIM1_CH2N)
KM6: U5.34(PB13/SPI2_SCK/TIM1_CH1N)
KM7: U5.33(PB12/SPI2_NSS/I2C2_SMBAI/TIM1_BKIN)
KM8: U5.27(PB1/ADC9/TIM3_CH4)
LD1: D43.K U5.2(PC13/ANT1)
LD2: D44.K U5.3(PC14/OSC32)
Light_Test: J1#2.2(GND) R91.2 R92.2 U5.22(PA6/SPI1_MISO/ADC6/TIM3_CH1) U6#1.1(out)
LightT: C45.2 J1#2.1(GND) J2#2.1(GND) R90.2
NRST: C37.2 R80.1 S1.2 S1.3 SWD1.5 U5.7(NRST)
PA2_USART2_TX: U5.16(PA2/U2_TX/ADC2/TIM2_CH3)
PA3_USART2_RX: U5.17(PA3/U2_RX/ADC3/TIM2_CH4)
PA8_RS485_2_RD: U5.15(PA1/ADC1/TIM2_CH2)
PA9_USART1_TX: D40.2(K) R83.1 U5.42(PA9/U1_TX/TIM1_CH2)
PA10_USART1_RX: D42.2(K) R84.1 U5.43(PA10/U1_RX/TIM1_CH3)
PB10_USART3_TX: U5.29(PB10/I2C2_SCL/U3_TX)
PB11_USART3_RX: U5.30(PB11/I2C2_SDA/U3_RX)
STM_SWC: SWD1.1 U5.49(PA14/JTCK/SWCLK)
STM_SWD: SWD1.2 U5.46(PA13/JTMS/SWDIO)
SW_DI1: U5.40(PC9)
SW_DI2: U5.41(PA8/TIM1_CH1/MCO)
SW_DI3: U5.44(PA11/CAN_RX/USBDM/TIM1_CH4)
SW_DI4: U5.45(PA12/CAN_TX/USBDP/TIM1_ETR)
SW_DI5: U5.50(PA15/JTDI)
SW_DI6: U5.51(PC10)
NetC35_2: C35.2 R81.2 U5.5(PD0/OSCIN) Y1.2(OSC2)
NetC36_2: C36.2 R81.1 U5.6(PD1/OSCOUT) Y1.1(OSC1)
NetD39_A: D39.A R79.2
NetD39_K: D39.K R83.2
NetD41_A: D41.A R78.2
NetD41_K: D41.K R84.2
NetD43_A: D43.A R87.2
NetD44_A: D44.A R88.2
NetD45_K: D45.K R92.1
NetJ2#2_2: J2#2.2(GND) U6#1.3(+)
NetR93_3: R93.3(TAP) U6#1.2(-)

Not connected (* = marked no-connect by the designer): U5 4(PC15/OSC32) 8(PC0/ADC10) 9(PC1/ADC11) 10(PC2/ADC12) 11(PC3/ADC13) 14(PA0/WKUP/ADC0/TIM2_CH1_ETR) 20(PA4/SPI1_NSS/ADC4) 21(PA5/SPI1_SCK/ADC5) 23(PA7/SPI1_MOSI/ADC7/TIM3_CH2) 24(PC4/ADC14) 25(PC5/ADC15) 26(PB0/ADC8/TIM3_CH3); U6#2 1(GND) 2(TXD) 3(RXD) 4(V3) 5(D+) 6(D-) 7(XI) 8(XO) 9(CTS#) 10(DSR#) 11(RI#) 12(DCD#) 13(DTR#) 14(RTS) 15(RS232) 16(VCC)

### Library data of the parts
C14#2 C15#2 C23#2 C39-C45 = CAP: Capacitor
C18#2 C19#2 C35 C36 = Cap: Capacitor; Published: 8-Jun-2000; LatestRevisionDate: 17-Jul-2002; LatestRevisionNote: Re-released for DXP Platform.; PackageReference: RAD-0.3; Publisher: Altium Limited; Value: 22pF
C37 = Cap: Capacitor; Value: 0.1uF; Published: 8-Jun-2000; LatestRevisionDate: 17-Jul-2002; LatestRevisionNote: Re-released for DXP Platform.; PackageReference: RAD-0.3; Publisher: Altium Limited
C38 = CAP: Capacitor; Value: 100nF; Published: 8-Jun-2000; Revision: July-2002: Re-released for DXP Platform.; Publisher: Altium Limited
CON1 = 4 HEADER: 4 Pin Header
D7#2 D16#2 = DIODE
D39 D41 D43-D45 = 0: 发光二极管; ComponentLink1Description: 供应商链接; ComponentLink1URL: http://www.szlcsc.com/product/details_73152.html; Package: 0603; Supplier: LC; SuppliersPartNumber: C72043
D40 D42 = Diode-Z: 稳压二极管; Published: 8-Jun-2000; LatestRevisionDate: 17-Jul-2002; LatestRevisionNote: Re-released for DXP Platform.; PackageReference: SMB; Publisher: Altium Limited; Code_JEDEC: DO-214-AA
E6#2 E11 = ELECTRO2: Electrolytic Capacitor
F2#3 = F: 保险丝
P14 = Header 8: Header, 8-Pin; LatestRevisionDate: 17-Jul-2002; LatestRevisionNote: Re-released for DXP Platform.; Publisher: Altium Limited
Q7 = S8050
R15#2 R78-R80 R85 R86 = Res2: Resistor; Published: 8-Jun-2000; LatestRevisionDate: 17-Jul-2002; LatestRevisionNote: Re-released for DXP Platform.; PackageReference: AXIAL-0.4; Publisher: Altium Limited; Value: 10K
R16#2 R17#2 R18#2 R81 = Res2: Resistor; Value: 10K; Published: 8-Jun-2000; LatestRevisionDate: 17-Jul-2002; LatestRevisionNote: Re-released for DXP Platform.; PackageReference: AXIAL-0.4; Publisher: Altium Limited
R28#2 R82 R89 = RES2
R83 R84 R87 R88 R90-R92 = R: 贴片电阻; Published: 8-Jun-2000; LatestRevisionDate: 17-Jul-2002; LatestRevisionNote: Re-released for DXP Platform.; PackageReference: AXIAL-0.4; Publisher: Altium Limited
  R87 R88 R92: Value: 1K
R93 = RPot: Potentiometer; Sim Note: Enter the Resistance value and the set point into parameter fields.; Set Position: 0.5; Published: 8-Jun-2000; LatestRevisionDate: 17-Jul-2002; LatestRevisionNote: Re-released for DXP Platform.; PackageReference: VR5; Publisher: Altium Limited; PackageDescription: Variable Resistor, Thru-Hole; 3 Leads; Value: 10K
S1 = SW-: 微动开关; Published: 24-Mar-1999; LatestRevisionDate: 17-Jul-2002; LatestRevisionNote: Re-released for DXP Platform.; PackageReference: SPST-2; Publisher: Altium Limited
S2 = SW-DIP8: 4009 Series DIP Switch, Raised actuator; Published: 24-Mar-1999; LatestRevisionDate: 17-Dec-2003; LatestRevisionNote: PCB Footprint replaced.; PackageReference: DIP-16-KEY; Publisher: Altium Limited; PackageDescription: DIP; 16 Leads; Row Spacing 7.62 mm; Pitch 2.54 mm; ComponentLink1Description: Manufacturer Link; ComponentLink1URL: http://www.oupiin.com/prodindx.html#Headers
SWD1 = Header 5: Header, 5-Pin; LatestRevisionDate: 17-Jul-2002; LatestRevisionNote: Re-released for DXP Platform.; Publisher: Altium Limited
U4 = AT24C02: EEROM存储器
U5 = STM32F103RBT6
USB1 = CON5: Connector
Y1 Y2 = XTAL: Crystal Oscillator; Published: 8-Jun-2000; LatestRevisionDate: 17-Jul-2002; LatestRevisionNote: Re-released for DXP Platform.; PackageReference: R38; Publisher: Altium Limited

## Nets that join several sheets
3V3: SIX-INPORT (6 pins), RS485 (ADuM1.1 C10.2 N1.1), POWER (5 pins), STM32F103最小系统板 (27 pins)
GNDIN: SIX-INPORT (7 pins), SIX_OUTPORT-V2 (D25.1 P2.19 U3.9), POWER (27 pins)
GNDISO: RS485 (7 pins), POWER (5 pins)
PutIn_3V3GND: SIX-INPORT (15 pins), RS485 (ADuM1.4 C10.1), SIX_OUTPORT-V2 (8 pins), POWER (7 pins), STM32F103最小系统板 (38 pins)
PutIn_12V: SIX-INPORT (F4.1), POWER (6 pins)
VCCIN5V: SIX_OUTPORT-V2 (D25.2 F11.1 P2.20 U3.10), POWER (12 pins)
VCCIN12V: SIX-INPORT (P1.20), POWER (F1.1)
VCCISO: RS485 (7 pins), POWER (B1.4 C7.1 E8.1)
KM1: SIX_OUTPORT-V2 (R55.2 R56.1), STM32F103最小系统板 (U5.39)
KM2: SIX_OUTPORT-V2 (R58.2 R59.1), STM32F103最小系统板 (U5.38)
KM3: SIX_OUTPORT-V2 (R60.2 R61.1), STM32F103最小系统板 (U5.37)
KM4: SIX_OUTPORT-V2 (R63.2 R64.1), STM32F103最小系统板 (U5.36)
KM5: SIX_OUTPORT-V2 (R66.2 R67.1), STM32F103最小系统板 (U5.35)
KM6: SIX_OUTPORT-V2 (R68.2 R69.1), STM32F103最小系统板 (U5.34)
KM7: SIX_OUTPORT-V2 (R71.2 R72.1), STM32F103最小系统板 (U5.33)
KM8: SIX_OUTPORT-V2 (R73.2 R75.1), STM32F103最小系统板 (U5.27)
LightT: SIX-INPORT (P1.5), STM32F103最小系统板 (C45.2 J1#2.1 J2#2.1 R90.2)
PA2_USART2_TX: RS485 (ADuM1.3), STM32F103最小系统板 (U5.16)
PA3_USART2_RX: RS485 (ADuM1.2), STM32F103最小系统板 (U5.17)
PA8_RS485_2_RD: RS485 (R8.1), STM32F103最小系统板 (U5.15)
PA9_USART1_TX: SIX-INPORT (P1.3), STM32F103最小系统板 (D40.2 R83.1 U5.42)
PA10_USART1_RX: SIX-INPORT (P1.4), STM32F103最小系统板 (D42.2 R84.1 U5.43)
RS458_A: RS485 (F3.2), SIX_OUTPORT-V2 (P2.18)
RS485_B: RS485 (F2#1.2), SIX_OUTPORT-V2 (P2.17)
SW_DI1: SIX-INPORT (C14#1.1 PHC1.4 R14.1), STM32F103最小系统板 (U5.40)
SW_DI2: SIX-INPORT (C15#1.1 PHC2.4 R20.1), STM32F103最小系统板 (U5.41)
SW_DI3: SIX-INPORT (C21.1 PHC3.4 R27.1), STM32F103最小系统板 (U5.44)
SW_DI4: SIX-INPORT (C25.1 PHC4.4 R33.1), STM32F103最小系统板 (U5.45)
SW_DI5: SIX-INPORT (C30.1 PHC5.4 R43.1), STM32F103最小系统板 (U5.50)
SW_DI6: SIX-INPORT (C33.1 PHC6.4 R48.1), STM32F103最小系统板 (U5.51)